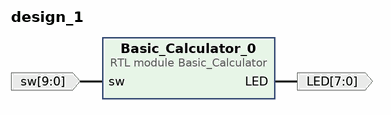
[diagram p0: block diagram of the top level]
# Vivado block design design_1, xc7a35tcpg236-1, Vivado 2021.1
create_bd_design design_1

create_bd_port -dir O -from 7 -to 0 LED
create_bd_port -dir I -from 9 -to 0 sw

create_bd_cell -type module -reference Basic_Calculator Basic_Calculator_0

# ---- connections ----

connect_bd_net [get_bd_pins Basic_Calculator_0/LED] [get_bd_ports LED]
connect_bd_net [get_bd_ports sw] [get_bd_pins Basic_Calculator_0/sw]

validate_bd_design
save_bd_design
